# Altium schematic sheet [08] - AUDIO.SchDoc: AUDIO
size A4; Organization: Bjørn T. Brodtkorb; Address1: Frode Rinnans veg 161; Address2: 7050 Trondheim; DocumentNumber: 6598; Revision: 1.0; SheetNumber: 1; SheetTotal: 1
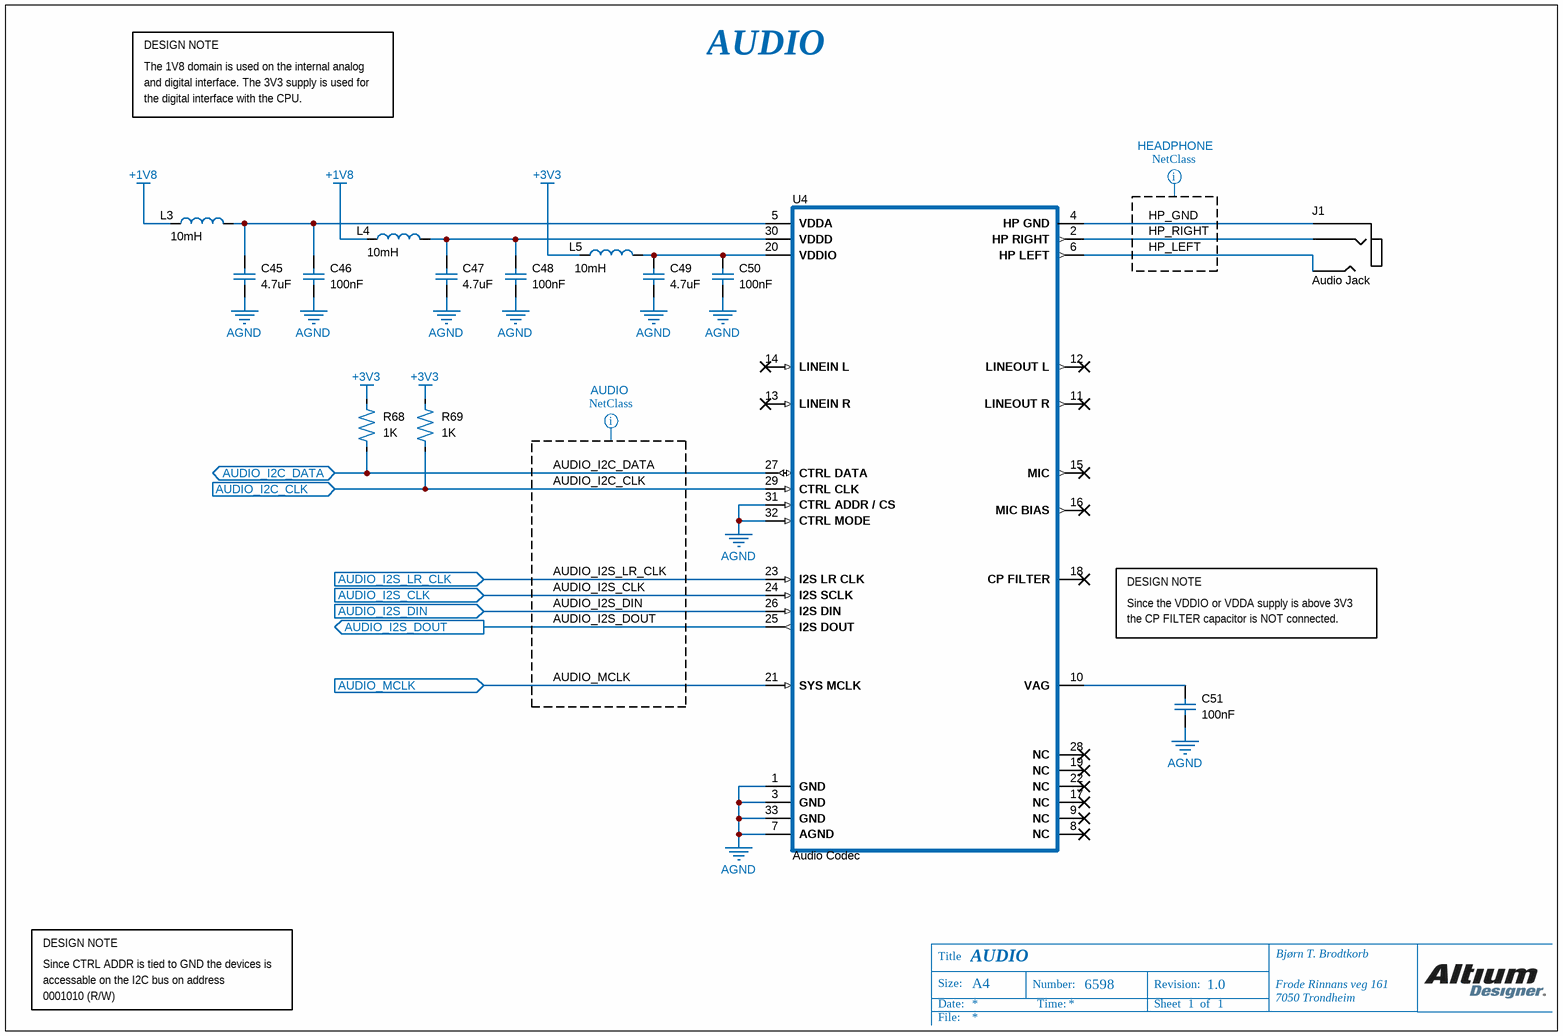
[diagram p0: [08] - AUDIO.SchDoc]

## Parts
C45  value 4.7uF  [C0603]  (hidden comment: 02016D104KAT2A)
C46  value 100nF  [C0402]  (hidden comment: 04023C103KAT2A)
C47  value 4.7uF  [C0603]  (hidden comment: 02016D104KAT2A)
C48  value 100nF  [C0402]  (hidden comment: 04023C103KAT2A)
C49  value 4.7uF  [C0603]  (hidden comment: 02016D104KAT2A)
C50  value 100nF  [C0402]  (hidden comment: 04023C103KAT2A)
C51  value 100nF  [C0402]  (hidden comment: 04023C103KAT2A)
J1  Audio Jack  [Audio jack barrel 3 contacts]
L3  value 10mH  [Inductor 0603]  (hidden comment: MLZ1608A2R2WT)
L4  value 10mH  [Inductor 0603]  (hidden comment: MLZ1608A2R2WT)
L5  value 10mH  [Inductor 0603]  (hidden comment: MLZ1608A2R2WT)
R68  value 1K  [R0402]  (hidden comment: CRCW04020000Z0ED)
R69  value 1K  [R0402]  (hidden comment: CRCW04020000Z0ED)
U4  Audio Codec  [SGTL5000XNAA3]

## Ports
AUDIO_I2C_CLK (in), AUDIO_I2C_DATA (bidir), AUDIO_I2S_CLK (in), AUDIO_I2S_DIN (in), AUDIO_I2S_DOUT (out), AUDIO_I2S_LR_CLK (in), AUDIO_MCLK (in)

## Nets
+1V8: L3.1 L4.1
+3V3: L5.1 R68.2 R69.2
AGND: C45.2 C46.2 C47.2 C48.2 C49.2 C50.2 C51.2 U4.1(GND) U4.3(GND) U4.7(AGND) U4.31(CTRL_ADDR_/_CS) U4.32(CTRL_MODE) U4.33(GND)
AUDIO_I2C_CLK: R69.1 U4.29(CTRL_CLK) ; port AUDIO_I2C_CLK
AUDIO_I2C_DATA: R68.1 U4.27(CTRL_DATA) ; port AUDIO_I2C_DATA
AUDIO_I2S_CLK: U4.24(I2S_SCLK) ; port AUDIO_I2S_CLK
AUDIO_I2S_DIN: U4.26(I2S_DIN) ; port AUDIO_I2S_DIN
AUDIO_I2S_DOUT: U4.25(I2S_DOUT) ; port AUDIO_I2S_DOUT
AUDIO_I2S_LR_CLK: U4.23(I2S_LR_CLK) ; port AUDIO_I2S_LR_CLK
AUDIO_MCLK: U4.21(SYS_MCLK) ; port AUDIO_MCLK
HP_GND: J1.1 U4.4(HP_GND)
HP_LEFT: J1.2 U4.6(HP_LEFT)
HP_RIGHT: J1.3 U4.2(HP_RIGHT)
NetC45_1: C45.1 C46.1 L3.2 U4.5(VDDA)
NetC47_1: C47.1 C48.1 L4.2 U4.30(VDDD)
NetC49_1: C49.1 C50.1 L5.2 U4.20(VDDIO)
NetC51_1: C51.1 U4.10(VAG)

Not connected (* = marked no-connect by the designer): U4 8(NC)* 9(NC)* 11(LINEOUT_R)* 12(LINEOUT_L)* 13(LINEIN_R)* 14(LINEIN_L)* 15(MIC)* 16(MIC_BIAS)* 17(NC)* 18(CP_FILTER)* 19(NC)* 22(NC)* 28(NC)*

## Layout directives
net class HEADPHONE: HP_GND, HP_LEFT, HP_RIGHT
net class AUDIO: AUDIO_I2C_CLK, AUDIO_I2C_DATA, AUDIO_I2S_CLK, AUDIO_I2S_DIN, AUDIO_I2S_DOUT, AUDIO_I2S_LR_CLK, AUDIO_MCLK

## Notes on the sheet
- DESIGN NOTE
- The 1V8 domain is used on the internal analog
- and digital interface. The 3V3 supply is used for
- the digital interface with the CPU.
- AUDIO
- Since the VDDIO or VDDA supply is above 3V3
- the CP FILTER capacitor is NOT connected.
- Since CTRL ADDR is tied to GND the devices is
- accessable on the I2C bus on address
- 0001010 (R/W)
- Title
- Size:
- A4
- Number:
- Revision:
- Date:
- File:
- Time:
- Sheet
- of

## Library data of the parts
C45 C47 C49 = 02016D104KAT2A: C0603
C46 C48 C50 C51 = 04023C103KAT2A: C0402
J1 = SJ-3524-SMT-TR: Audio jack barrel 3 contacts; Supplier Part Number 1: CP-3524SJCT-ND; Supplier 1: Digi-Key
L3-L5 = MLZ1608A2R2WT: Inductor 0603
R68 R69 = CRCW04020000Z0ED: R0402
U4 = SGTL5000XNAA3: Audio codec w/ headophone amp; ADC resolution: 24 bit; Sampling rate: 96 kSPS; Supplier 1: Farnell; Supplier Part Number 1: 2308049